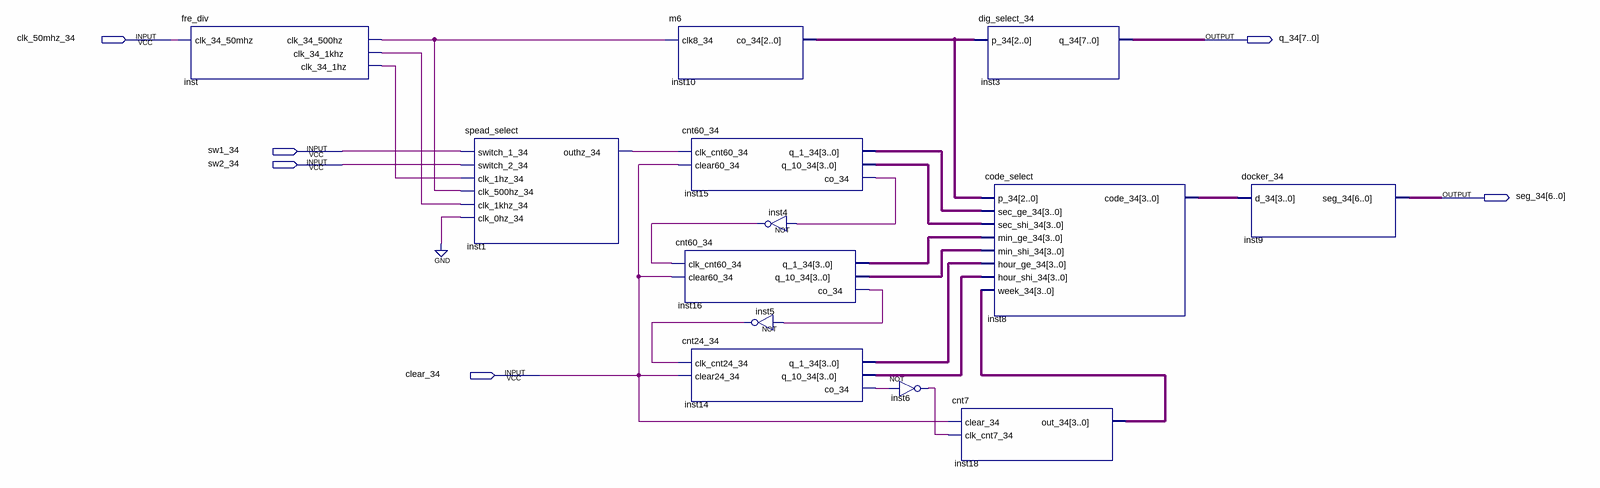
[diagram p0: schematic sheet]
// Quartus schematic main_34.bdf as structural Verilog: 13 symbols, 6 pins
module main_34 (
  input  clk_50mhz_34,
  input  sw1_34,
  input  sw2_34,
  input  clear_34,
  output [7:0] q_34,
  output [6:0] seg_34
);

  wire inst1_outhz_34, inst4_out, inst5_out, inst6_out, inst14_co_34, inst15_co_34, inst16_co_34,
       inst_clk_34_1hz, inst_clk_34_1khz, inst_clk_34_500hz;
  wire [2:0] inst10_co_34;
  wire [3:0] inst8_code_34, inst14_q_1_34, inst14_q_10_34, inst15_q_1_34, inst15_q_10_34, inst16_q_1_34,
       inst16_q_10_34, inst18_out_34;

  fre_div inst (
    .clk_34_50mhz(clk_50mhz_34), .clk_34_500hz(inst_clk_34_500hz), .clk_34_1khz(inst_clk_34_1khz),
    .clk_34_1hz(inst_clk_34_1hz));
  spead_select inst1 (
    .switch_1_34(sw1_34), .switch_2_34(sw2_34), .clk_1hz_34(inst_clk_34_1hz),
    .clk_500hz_34(inst_clk_34_500hz), .clk_1khz_34(inst_clk_34_1khz), .clk_0hz_34(1'b0),
    .outhz_34(inst1_outhz_34));
  m6 inst10 (.clk8_34(inst_clk_34_500hz), .co_34(inst10_co_34));
  cnt60_34 inst15 (
    .clk_cnt60_34(inst1_outhz_34), .clear60_34(clear_34), .q_1_34(inst15_q_1_34), .q_10_34(inst15_q_10_34),
    .co_34(inst15_co_34));
  cnt60_34 inst16 (
    .clk_cnt60_34(inst4_out), .clear60_34(clear_34), .q_1_34(inst16_q_1_34), .q_10_34(inst16_q_10_34),
    .co_34(inst16_co_34));
  cnt24_34 inst14 (
    .clk_cnt24_34(inst5_out), .clear24_34(clear_34), .q_1_34(inst14_q_1_34), .q_10_34(inst14_q_10_34),
    .co_34(inst14_co_34));
  not inst5 (inst5_out, inst16_co_34);
  not inst4 (inst4_out, inst15_co_34);
  not inst6 (inst6_out, inst14_co_34);
  cnt7 inst18 (.clear_34(clear_34), .clk_cnt7_34(inst6_out), .out_34(inst18_out_34));
  dig_select_34 inst3 (.p_34(inst10_co_34), .q_34(q_34));
  code_select inst8 (
    .p_34(inst10_co_34), .sec_ge_34(inst15_q_1_34), .sec_shi_34(inst15_q_10_34), .min_ge_34(inst16_q_1_34),
    .min_shi_34(inst16_q_10_34), .hour_ge_34(inst14_q_1_34), .hour_shi_34(inst14_q_10_34),
    .week_34(inst18_out_34), .code_34(inst8_code_34));
  docker_34 inst9 (.d_34(inst8_code_34), .seg_34(seg_34));
endmodule
